# Altium schematic sheet BlockDiagram.SchDoc
size A3; DocumentNumber: 2; SheetNumber: 2; SheetTotal: 5; ProjectDescription: Uçuş Kontrol Kartı
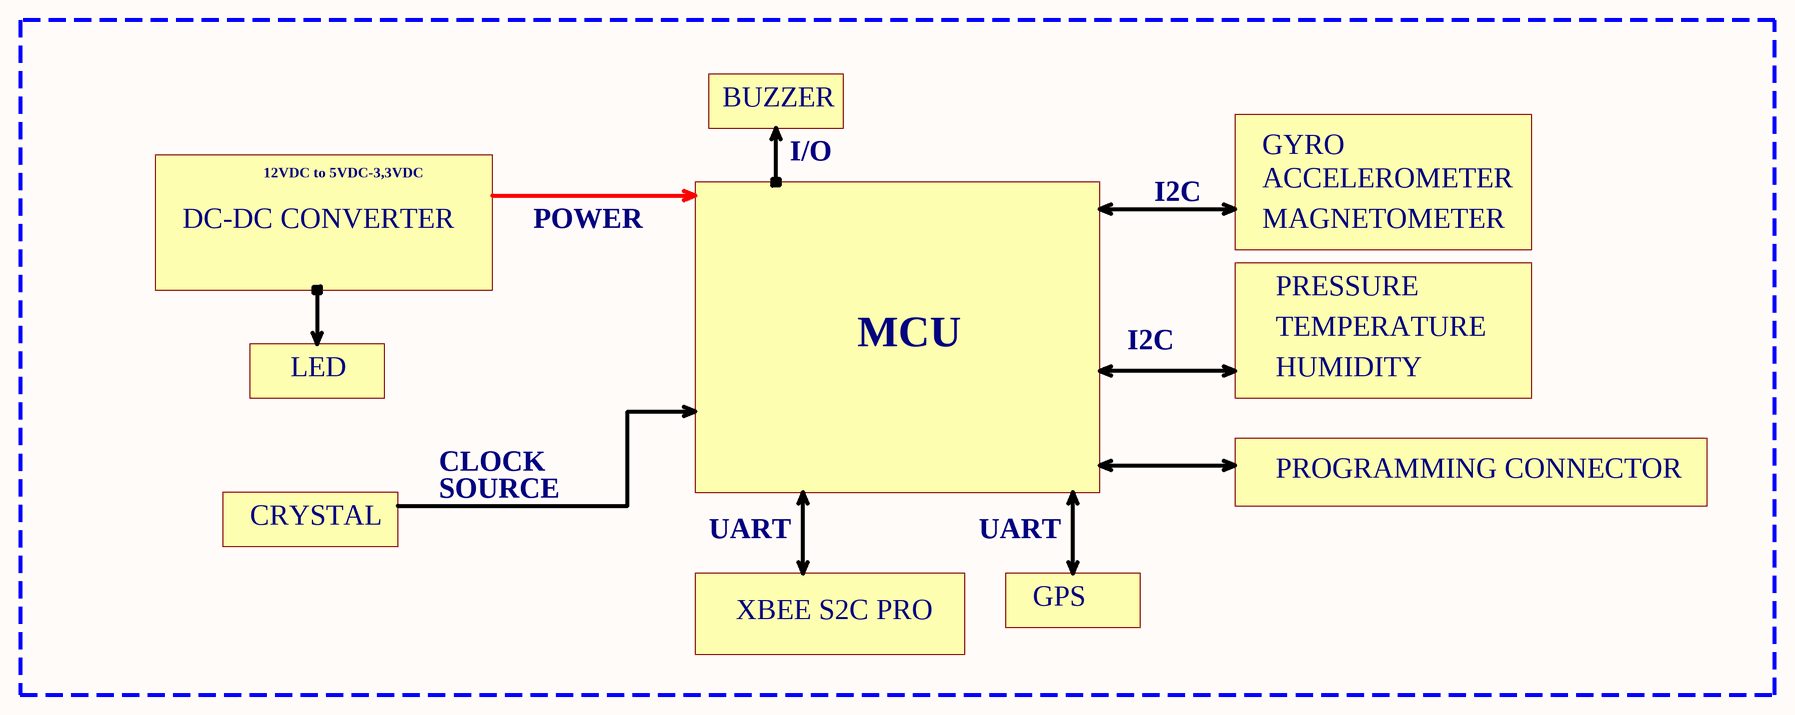
[diagram p0: BlockDiagram.SchDoc]

## Notes on the sheet
- BUZZER
- 12VDC to 5VDC-3,3VDC
- I/O
- GYRO
- DC-DC CONVERTER
- POWER
- I2C
- ACCELEROMETER
- MAGNETOMETER
- PRESSURE
- LED
- MCU
- TEMPERATURE
- HUMIDITY
- CLOCK
- SOURCE
- PROGRAMMING CONNECTOR
- CRYSTAL
- UART
- XBEE S2C PRO
- GPS
- DOSYA ADI / FILE NAME
- TANIM / DESCRIPTION
- HAZIRLAYAN / PREPARED BY
- YAYIN TARİHİ / REL. DATE
- BOYUT / SIZE
- SAYFA / SHEET
- /